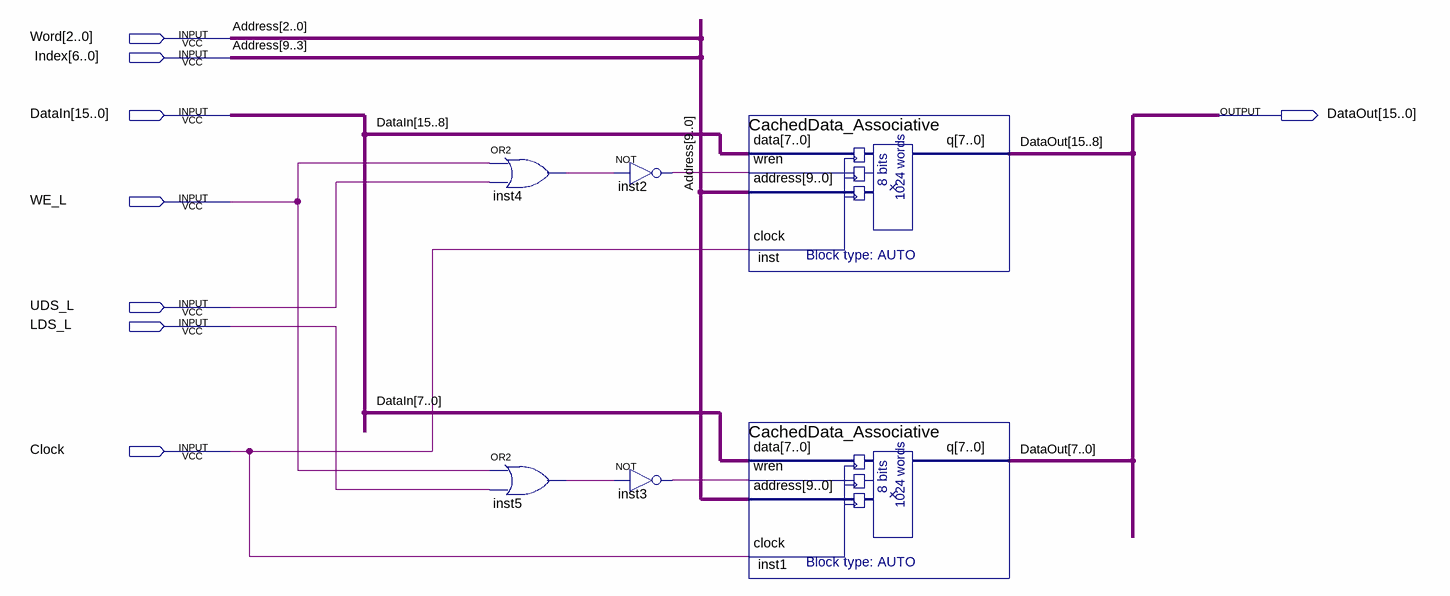
[diagram p0: schematic sheet]
// Quartus schematic CacheData_Associative.bdf as structural Verilog: 6 symbols, 8 pins
module CacheData_Associative (
  input  [2:0] Word,
  input  [6:0] Index,
  input  [15:0] DataIn,
  input  WE_L,
  input  UDS_L,
  input  LDS_L,
  input  Clock,
  output [15:0] DataOut
);

  wire inst2_out, inst3_out, inst4_out, inst5_out;

  or inst4 (inst4_out, WE_L, UDS_L);
  or inst5 (inst5_out, WE_L, LDS_L);
  not inst2 (inst2_out, inst4_out);
  not inst3 (inst3_out, inst5_out);
  CachedData_Associative inst (
    .data(DataIn[15:8]), .wren(inst2_out), .address({Index, Word}), .clock(Clock), .q(DataOut[15:8]));
  CachedData_Associative inst1 (
    .data(DataIn[7:0]), .wren(inst3_out), .address({Index, Word}), .clock(Clock), .q(DataOut[7:0]));

  // Other names for the same wires on the sheet: Address[9:0] = {Index, Word}
endmodule
